# EAGLE board working (EAGLE 8.7.0), part 1 of 2
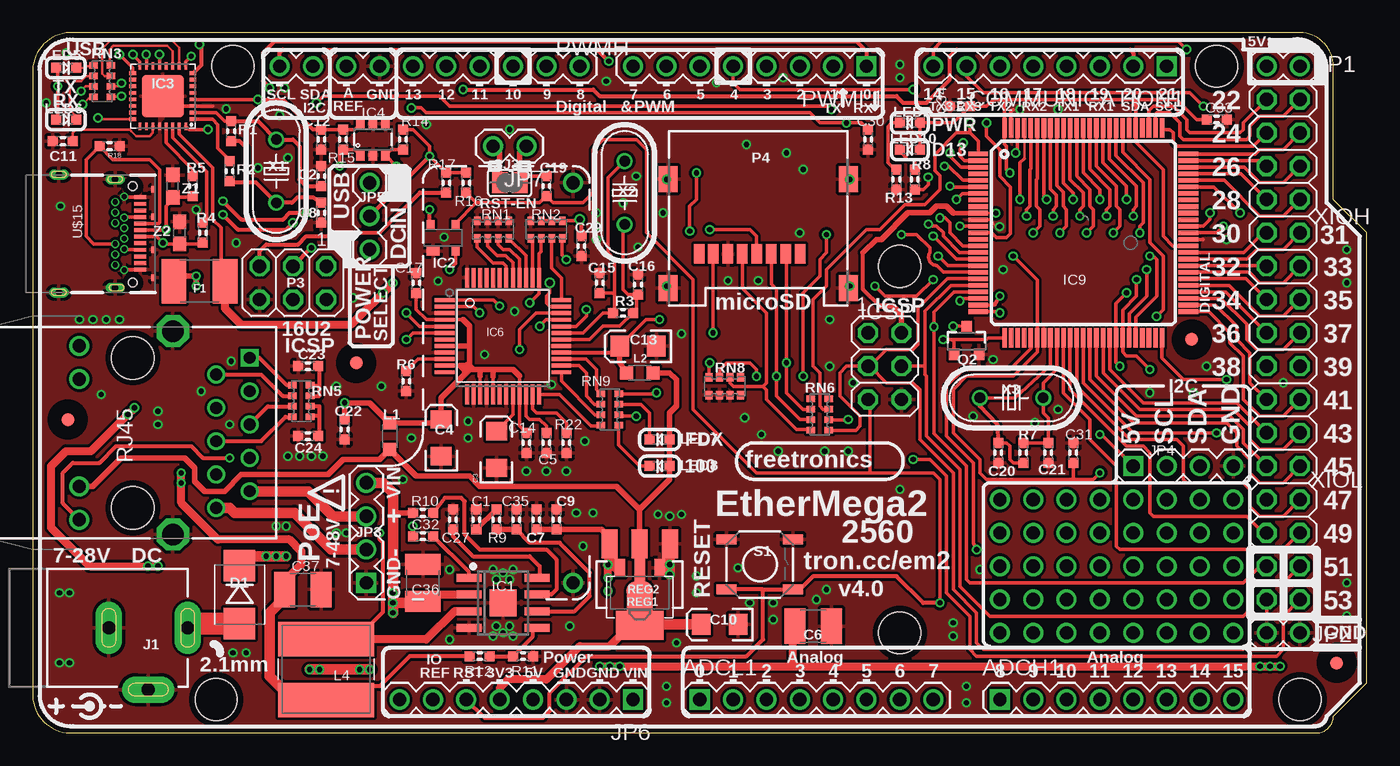
[diagram p1: board, top side]
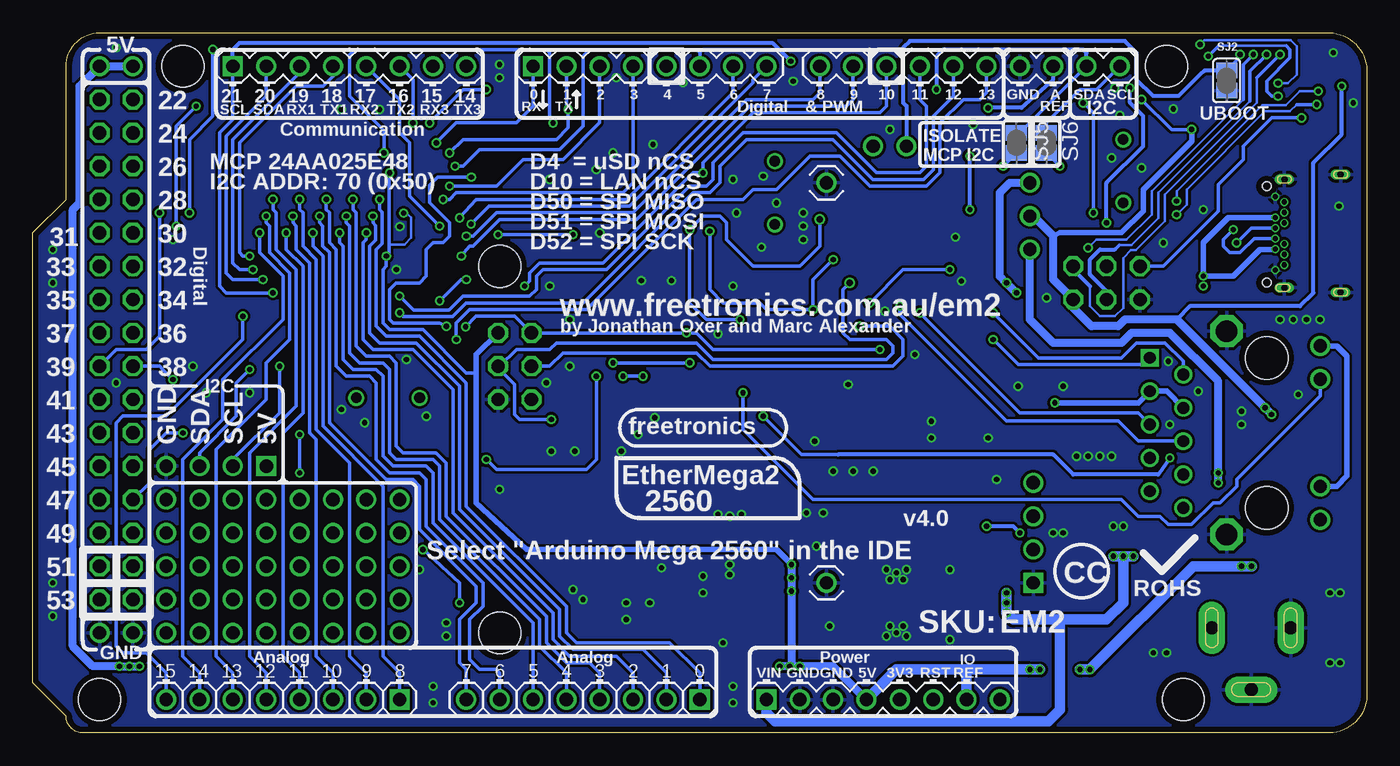
[diagram p2: board, bottom side, seen from below]

Size 101.6 x 53.34 mm. Coordinates in mm from the lower left corner, seen from the top.
Outline: 0,2.54 arc74 2.54,0 97.79,0 arc90 99.06,1.27 101.6,3.81 101.6,38.1 99.06,40.64 99.06,50.8 arc90 96.52,53.34 2.54,53.34 arc74 0,50.8 0,2.54
Copper layers (1*16): Top 0.035mm / dielectric 1.5mm / Bottom 0.035mm
Design rules "default *": minimum track width 8mil, minimum drill 15mil, track to track 8mil, track to pad 8mil, pad to pad 8mil, via to via 8mil, smd to smd 6mil, copper to edge 18mil, drill to drill 8mil, minimum pad ring 4mil, minimum via ring 6mil, stop-mask expansion 4mil, vias tented up to drill 25mil, thermal gap 10mil
Holes 3.2 mm at 66.04,35.56 66.04,7.62 13.97,2.54 15.24,50.8 96.52,2.54 90.17,50.8
tRestrict: area 23.6,27.2 to 25.7,29.2; area 87.2,29 to 89.3,31; area 1.7,22.9 to 3.7,24.9; area 98.3,4.3 to 100.3,6.3

## Footprints (pad centres in the part's own frame; a part is rotated, then mirrored left to right if it is on the bottom)
1X08 = drill 1.016 square: 1 0,0 | drill 1.016: 2 2.54,0; 3 5.08,0; 4 7.62,0; 5 10.16,0; 6 12.7,0; 7 15.24,0; 8 17.78,0
0603 = smd 0.762 x 0.762: 1 -0.762,0; 2 0.762,0
EIA3216 = smd 1.4 x 1.6: A 1.4,0; C -1.4,0
C1210 = smd 1.6 x 2.7: 1 -1.4,0; 2 1.4,0
SMB-DIODE = smd 2.4 x 2.4: A 2.2,0; C -2.2,0
L1812 = smd 1.9 x 3.4: 1 -1.95,0; 2 1.95,0
FIDUCIAL-1X2.5 = smd 1 x 1: 1 0,0
SO08T = smd 1.905 x 0.6: 1 -2.6,1.905; 2 -2.6,0.635; 3 -2.6,-0.635; 4 -2.6,-1.905; 5 2.6,-1.905; 6 2.6,-0.635; 7 2.6,0.635; 8 2.6,1.905 | smd 2.057 x 2.057: 9 0,0
SOT143-R = smd 1 x 0.7: 1 -0.75,-1 | smd 0.6 x 0.7: 2 0.95,-1; 3 0.95,1; 4 -0.95,1
ATMEL_QFN32 = smd 0.6 x 0.3: 1 -2.3,1.75; 2 -2.3,1.25; 3 -2.3,0.75; 4 -2.3,0.25; 5 -2.3,-0.25; 6 -2.3,-0.75; 7 -2.3,-1.25; 8 -2.3,-1.75; 17 2.3,-1.75; 18 2.3,-1.25; 19 2.3,-0.75; 20 2.3,-0.25; 21 2.3,0.25; 22 2.3,0.75; 23 2.3,1.25; 24 2.3,1.75 | smd 0.3 x 0.6: 9 -1.75,-2.3; 10 -1.25,-2.3; 11 -0.75,-2.3; 12 -0.25,-2.3; 13 0.25,-2.3; 14 0.75,-2.3; 15 1.25,-2.3; 16 1.75,-2.3; 25 1.75,2.3; 26 1.25,2.3; 27 0.75,2.3; 28 0.25,2.3; 29 -0.25,2.3; 30 -0.75,2.3; 31 -1.25,2.3; 32 -1.75,2.3 | smd 3.2 x 3.2: EXP 0,0
SOT23-6 = smd 0.65 x 0.8: 1 -0.95,-1.2; 2 0,-1.2; 3 0.95,-1.2; 4 0.95,1.2; 5 0,1.2; 6 -0.95,1.2
W5500 = smd 1.5 x 0.3: 1 -4.45,2.75; 2 -4.45,2.25; 3 -4.45,1.75; 4 -4.45,1.25; 5 -4.45,0.75; 6 -4.45,0.25; 7 -4.45,-0.25; 8 -4.45,-0.75; 9 -4.45,-1.25; 10 -4.45,-1.75; 11 -4.45,-2.25; 12 -4.45,-2.75; 25 4.45,-2.75; 26 4.45,-2.25; 27 4.45,-1.75; 28 4.45,-1.25; 29 4.45,-0.75; 30 4.45,-0.25; 31 4.45,0.25; 32 4.45,0.75; 33 4.45,1.25; 34 4.45,1.75; 35 4.45,2.25; 36 4.45,2.75 | smd 0.3 x 1.5: 13 -2.75,-4.45; 14 -2.25,-4.45; 15 -1.75,-4.45; 16 -1.25,-4.45; 17 -0.75,-4.45; 18 -0.25,-4.45; 19 0.25,-4.45; 20 0.75,-4.45; 21 1.25,-4.45; 22 1.75,-4.45; 23 2.25,-4.45; 24 2.75,-4.45; 37 2.75,4.45; 38 2.25,4.45; 39 1.75,4.45; 40 1.25,4.45; 41 0.75,4.45; 42 0.25,4.45; 43 -0.25,4.45; 44 -0.75,4.45; 45 -1.25,4.45; 46 -1.75,4.45; 47 -2.25,4.45; 48 -2.75,4.45
TQFP100 = smd 1.5 x 0.35: 1 -8,6; 2 -8,5.5; 3 -8,5; 4 -8,4.5; 5 -8,4; 6 -8,3.5; 7 -8,3; 8 -8,2.5; 9 -8,2; 10 -8,1.5; 11 -8,1; 12 -8,0.5; 13 -8,0; 14 -8,-0.5; 15 -8,-1; 16 -8,-1.5; 17 -8,-2; 18 -8,-2.5; 19 -8,-3; 20 -8,-3.5; 21 -8,-4; 22 -8,-4.5; 23 -8,-5; 24 -8,-5.5; 25 -8,-6; 51 8,-6; 52 8,-5.5; 53 8,-5; 54 8,-4.5; 55 8,-4; 56 8,-3.5; 57 8,-3; 58 8,-2.5; 59 8,-2; 60 8,-1.5; 61 8,-1; 62 8,-0.5; 63 8,0; 64 8,0.5; 65 8,1; 66 8,1.5; 67 8,2; 68 8,2.5; 69 8,3; 70 8,3.5; 71 8,4; 72 8,4.5; 73 8,5; 74 8,5.5; 75 8,6 | smd 0.35 x 1.5: 26 -6,-8; 27 -5.5,-8; 28 -5,-8; 29 -4.5,-8; 30 -4,-8; 31 -3.5,-8; 32 -3,-8; 33 -2.5,-8; 34 -2,-8; 35 -1.5,-8; 36 -1,-8; 37 -0.5,-8; 38 0,-8; 39 0.5,-8; 40 1,-8; 41 1.5,-8; 42 2,-8; 43 2.5,-8; 44 3,-8; 45 3.5,-8; 46 4,-8; 47 4.5,-8; 48 5,-8; 49 5.5,-8; 50 6,-8; 76 6,8; 77 5.5,8; 78 5,8; 79 4.5,8; 80 4,8; 81 3.5,8; 82 3,8; 83 2.5,8; 84 2,8; 85 1.5,8; 86 1,8; 87 0.5,8; 88 0,8; 89 -0.5,8; 90 -1,8; 91 -1.5,8; 92 -2,8; 93 -2.5,8; 94 -3,8; 95 -3.5,8; 96 -4,8; 97 -4.5,8; 98 -5,8; 99 -5.5,8; 100 -6,8
2X03 = drill 1.016 octagon: 1 -2.54,-1.27; 2 -2.54,1.27; 3 0,-1.27; 4 0,1.27; 5 2.54,-1.27; 6 2.54,1.27
POWER_JACK_PTH_SLOTS = drill 1 pad 2 long: GND 0,7.7; GNDBREAK 4.7,10.7; PWR 0,13.7
1X02 = drill 1.016: 1 0,0; 2 2.54,0
FT-POE-MODULE-CLEAN = drill 1.016 square: 1 0,0 | drill 1.016: 2 2.54,0; 3 5.08,0; 4 7.62,0; MNT1 0,-15.748; MNT2 30.48,-15.748
1X04 = drill 1.016 square: 1 0,0 | drill 1.016: 2 2.54,0; 3 5.08,0; 4 7.62,0
1X03 = drill 1.016: 1 0,0; 2 2.54,0; 3 5.08,0
L2012C = smd 1 x 1: 1 -1,0; 2 1,0
CDRH = smd 7.3 x 2.65: 1 0,2.325; 2 0,-2.325
LED-0603 = smd 0.762 x 0.762: A -0.762,0; C 0.762,0
MOLEX-SD-500901-003 = smd 0.8 x 1.5: 1 -3.2,9.35; 2 -2.1,9.35; 3 -1,9.35; 4 0.1,9.35; 5 1.2,9.35; 6 2.3,9.35; 7 3.4,9.35; 8 4.5,9.35 | smd 1.45 x 2: GND1 6.875,11.95; GND2 -6.875,11.95; GND3 6.875,3.65; GND4 -6.875,3.65
1X10 = drill 1.016: 1 0,0; 2 2.54,0; 3 5.08,0; 4 7.62,0; 5 10.16,0; 6 12.7,0; 7 15.24,0; 8 17.78,0; 9 20.32,0; 10 22.86,0
SOT23-3 = smd 0.8 x 0.9: 1 -0.95,-1; 2 0.95,-1; 3 0,1.1
SOT89 = smd 0.8 x 1.4: 1 -1.524,-1.905; 3 1.524,-1.905 | smd 0.8 x 1.9: 2 0,-1.651 | smd 2.032 x 3.65: 4 0,0.94
SOT223 = smd 1.219 x 2.235: 1 -2.311,-3.099; 2 0,-3.099; 3 2.311,-3.099 | smd 3.6 x 2.2: 4 0,3.099
CAY16 = smd 0.5 x 0.65: 1 -1.2,-0.675; 2 -0.4,-0.675; 3 0.4,-0.675; 4 1.2,-0.675; 5 1.2,0.675; 6 0.4,0.675; 7 -0.4,0.675; 8 -1.2,0.675
TACTILE_SWITCH_SMD = smd 1.524 x 0.762: 1 -2.54,1.905; 2 2.54,1.905; 3 -2.54,-1.905; 4 2.54,-1.905
SJ = smd 1.168 x 1.6: 1 -0.762,0; 2 0.762,0
SJC = smd 1.168 x 1.6: 1 -0.762,0; 2 0.762,0
HY931147C = drill 1.63 octagon: GND1 3.05,7.745; GND2 3.05,-7.745 | drill 0.9 square: P$1 8.89,5.715 | drill 0.9: P$2 6.35,4.445; P$3 8.89,3.175; P$4 6.35,1.905; P$5 8.89,0.635; P$6 6.35,-0.635; P$7 8.89,-1.905; P$8 6.35,-3.175; P$9 8.89,-4.445; P$10 6.35,-5.715 | drill 1.016: P$11 -4.08,6.625; P$12 -4.08,4.085; P$13 -4.08,-4.085; P$14 -4.08,-6.625 | hole 3.25: 0,5.715; 0,-5.715
USB-C-U52A = smd 0.3 x 0.9: A1 0.85,0.56; A2 1.35,0.56; A3 1.85,0.56; A4 2.35,0.56; A5 2.85,0.56; A6 3.35,0.56; A7 3.85,0.56; A8 4.35,0.56; A9 4.85,0.56; A10 5.35,0.56; A11 5.85,0.56; A12 6.35,0.56 | drill 0.4 pad 0.6: B1 6.4,-0.65; B2 6,-1.35; B3 5.2,-1.35; B4 4.8,-0.65; B5 4.4,-1.35; B6 4,-0.65; B7 3.2,-0.65; B8 2.8,-1.35; B9 2.4,-0.65; B10 2,-1.35; B11 1.2,-1.35; B12 0.8,-0.65 | smd 0.5 x 0.3: CASE1 0.23,1.55; CASE2 2.35,1.55; CASE3 4.85,1.55; CASE4 6.98,1.55 | drill 0.5 pad 0.7 long: FIX1 -0.89,-5.64; FIX2 -0.53,-1.35; FIX3 7.73,-1.35; FIX4 8.09,-5.64 | hole 0.65: 7.35,0; 0,0
HC49U-V = drill 0.813: 1 -2.413,0; 2 2.413,0
2X08 = drill 1.016 octagon: 1 -8.89,-1.27; 2 -8.89,1.27; 3 -6.35,-1.27; 4 -6.35,1.27; 5 -3.81,-1.27; 6 -3.81,1.27; 7 -1.27,-1.27; 8 -1.27,1.27; 9 1.27,-1.27; 10 1.27,1.27; 11 3.81,-1.27; 12 3.81,1.27; 13 6.35,-1.27; 14 6.35,1.27; 15 8.89,-1.27; 16 8.89,1.27
0603' = smd 1.1 x 1: 1 -0.85,0; 2 0.85,0

## Placement (x,y rotation side)
ADCH1  [1X08]  73.66,2.54 0 top
ADCL1  [1X08]  50.8,2.54 0 top
C1  2.2nF 0603  [0603]  33.78,16.26 90 top
C2  22pF 0603  [0603]  21.97,42.42 270 top
C3  4.7uF 6.3V A TANT  [EIA3216]  35.31,21.59 90 top
C4  10uF 6.3V A TANT  [EIA3216]  31.11,22.48 90 top
C5  10nF  [0603]  39.12,22.1 270 top
C6  47uF 50V 1210 ceramic  [C1210]  59.44,8.13 180 top
C7  100nF 0603  [0603]  38.35,16.26 90 top
C8  22pF 0603  [0603]  21.97,39.62 90 top
C9  1uF 0603  [0603]  39.88,16.26 90 top
C10  10uF 6.3V A TANT  [EIA3216]  52.32,8.26 180 top
C11  1uF 0603  [0603]  2.29,45.09 180 top
C12  100nF 0603  [0603]  21.97,45.21 270 top
C13  10uF 6.3V A TANT  [EIA3216]  46.1,29.46 180 top
C14  100nF  [0603]  37.59,22.1 270 top
C15  13pF  [0603]  43.18,34.29 90 top
C16  13pF  [0603]  46.1,34.16 90 top
C17  100nF  [0603]  29.21,34.29 90 top
C19  100nF 0603  [0603]  39.12,41.66 270 top
C20  22pF 0603  [0603]  73.53,21.34 90 top
C21  22pF 0603  [0603]  77.34,21.34 90 top
C22  100nF  [0603]  23.75,23.11 270 top
C23  100nF  [0603]  20.95,27.94 180 top
C24  100nF  [0603]  20.95,22.61 180 top
C27  100nF 0603  [0603]  32,16.26 90 top
C29  100nF 0603  [0603]  41.78,37.08 270 top
C30  100nF  [0603]  63.63,45.21 270 top
C31  100nF  [0603]  79.25,21.34 90 top
C32  10nF 50V 0603  [0603]  29.72,14.99 0 top
C33  100nF  [0603]  90.17,46.74 0 top
C34  100nF  [0603]  70.61,47.75 180 top
C35  22pF NOT PLACED  [0603]  36.83,16.26 90 top
C36  10uF 50V 1210 ceramic  [C1210]  29.72,11.43 90 top
C37  22uF 10V 1210 ceramic  [C1210]  20.57,10.92 0 top
COMMUNICATION1  [1X08]  86.36,50.8 180 top
D1  1N4004 SMB  [SMB-DIODE]  15.75,10.54 270 top
F1  500mA PTC 1812  [L1812]  12.7,34.42 0 top
FID1  FIDUCIAL1X2.5  [FIDUCIAL-1X2.5]  24.64,28.19 0 top
FID2  FIDUCIAL1X2.5  [FIDUCIAL-1X2.5]  88.27,29.97 0 top
FID3  FIDUCIAL1X2.5  [FIDUCIAL-1X2.5]  2.67,23.88 0 top
FID4  FIDUCIAL1X2.5  [FIDUCIAL-1X2.5]  99.31,5.33 90 top
IC1  EUP3476SO08T  [SO08T]  35.81,9.91 0 top
IC2  APX811-44UG-7  [SOT143-R]  31.24,37.72 0 top
IC3  ATMEGA16U2-MU  [ATMEL_QFN32]  9.91,48.51 180 top
IC4  MCP24AA025E48  [SOT23-6]  25.91,45.21 0 top
IC6  W5500  [W5500]  35.81,30.23 0 top
IC9  ATMEGA2560-16AU  [TQFP100]  80.01,38.1 0 top
ICSP  ICSP:MAIN  [2X03]  64.9,27.94 270 top
J1  DC_2_1MM  [POWER_JACK_PTH_SLOTS]  -1.91,8 270 top
JP1  [1X02]  93.98,50.8 0 top
JP2  [1X02]  93.98,7.62 0 top
JP3  FT-POE-MODULE  [FT-POE-MODULE-CLEAN]  25.4,11.43 90 top
JP4  [1X04]  83.82,20.32 0 top
JP5  [1X03]  25.65,41.91 270 top
JP6  [1X08]  45.72,2.54 180 top
JP7  [1X02]  37.59,44.7 180 top
L1  Bourns MH2029-300Y 30R 3A 0805  [L2012C]  27.18,22.61 90 top
L2  Bourns MH2029-300Y 30R 3A 0805  [L2012C]  46.23,27.43 180 top
L4  CDRH6D38SMT  [CDRH]  22.35,4.83 0 top
LED2  PWR/BLUE  [LED-0603]  66.8,46.48 180 top
LED5  TX/YEL  [LED-0603]  2.54,50.67 0 top
LED6  RX/GRN  [LED-0603]  2.54,46.74 0 top
LED7  GREEN  [LED-0603]  47.75,22.35 180 top
LED8  YELLOW  [LED-0603]  47.75,20.32 180 top
LED10  D13/RED  [LED-0603]  66.8,44.45 180 top
P3  ICSP:USB  [2X03]  19.81,34.29 180 top
P4  microSD  [MOLEX-SD-500901-003]  55.24,45.85 180 top
PWMH  [1X10]  41.66,50.8 180 top
PWML1  [1X08]  63.5,50.8 180 top
Q2  2N7002  [SOT23-3]  71.12,29.84 0 top
R1  1M 0603  [0603]  15.11,45.85 90 top
R2  27R 0603  [0603]  14.99,42.8 270 top
R3  1M  [0603]  44.96,32 0 top
R4  22R 0603  [0603]  12.95,38.1 270 top
R5  22R 0603  [0603]  12.19,41.66 270 top
R6  12K3 1%  [0603]  28.45,26.8 90 top
R7  1M 0603  [0603]  75.44,21.34 270 top
R8  1K 0603  [0603]  67.18,42.16 90 top
R9  15K 0603  [0603]  35.31,16.26 270 top
R10  100K 0603  [0603]  29.72,16.76 0 top
R11  10K 1%  [0603]  37.34,5.84 180 top
R12  53.6K 1%  [0603]  34.04,5.84 180 top
R13  1K 0603  [0603]  65.79,42.16 90 top
R14  4K7  [0603]  28.19,45.21 270 top
R15  4K7  [0603]  23.62,45.21 270 top
R16  10K 0603  [0603]  33.02,41.91 90 top
R17  10K 0603  [0603]  31.5,41.91 90 top
R18  5.1K  [0603]  5.84,44.7 180 top
R22  10K  [0603]  40.64,22.1 90 top
REG1  LD1117-SOT89  [SOT89]  46.23,10.67 180 top
REG2  LD1117-SOT223  [SOT223]  46.23,11.3 180 top
RN1  10K  [CAY16]  35.05,38.35 0 top
RN2  10K  [CAY16]  39.12,38.35 0 top
RN3  1K  [CAY16]  5.28,49.66 270 top
RN5  49R9 1%  [CAY16]  20.45,25.27 270 top
RN6  1K  [CAY16]  59.94,24.26 270 top
RN8  2K2  [CAY16]  52.7,26.42 0 top
RN9  1K  [CAY16]  43.94,24.64 270 top
S1  RESET  [TACTILE_SWITCH_SMD]  55.37,12.83 0 top
SJ2  UBOOT  [SJ]  10.67,49.7 90 bottom
SJ3  RESET-EN  [SJC]  36.32,41.91 0 top
SJ5  [SJC]  26.67,44.96 270 bottom
SJ6  [SJC]  24.38,44.96 270 bottom
U1  HY931147C-RJ45  [HY931147C]  7.62,22.86 0 top
U$15  USB-C  [USB-C-U52A]  7.62,41.66 270 top
X1  16MHz  [HC49U-V]  18.54,42.8 90 top
X2  25MHz  [HC49U-V]  45.09,41.15 270 top
X3  16MHz  [HC49U-V]  74.55,25.53 180 top
XIOH  [2X08]  95.25,39.37 90 top
XIOL  [2X08]  95.25,19.05 90 top
Z1  PGB1010603  [0603']  10.67,41.66 90 top
Z2  PGB1010603  [0603']  11.18,38.1 90 top

## Tracks (layer width: path | path; a pad name or v marks a point on that pad's centre or on a via)
3.3V
  Top 0.254: C10.A 50.8,8.38
  Top 0.305: REG1.4 REG2.4 | REG2.2 46.23,14.35
  Top 0.406: U1.P$13 4.55,18.77 6.73,20.95 11.56,20.95 12.32,20.19 12.32,19.18 13.08,18.41 14.61,18.41 15.88,19.68 22.48,19.68 23.62,20.83 26.42,20.83 27.18,21.59 | 27.18,21.59 29.21,19.56 33.27,19.56 34.04,18.8 44.45,18.8 46.23,17.02 | 46.23,17.02 REG2.2 | 46.23,17.02 48.51,19.3 LED8.A LED7.A 48.51,24.38 49.02,24.89 49.02,26.92 48.51,27.43 L2.1 | L1.1 27.18,21.59
  Top 0.61: JP6.5 35.56,3.43 36.2,4.06 39.12,4.06 41.66,6.6 43.95,6.6 45.22,7.87 45.9,7.87 REG2.4 46.18,8.26 | REG1.2 REG1.4
  Top 0.813: REG2.2 REG1.2 | 46.18,8.26 C10.A | 45.9,7.87 45.21,7.87
  Bottom 0.406: U1.P$13 2.29,18.8 1.52,19.56 1.52,28.7 2.29,29.46 U1.P$11
3V3A  (via drill 0.4)
  Top 0.254: IC6.17 35.06,27.17 | IC6.15 34.06,27.21 | 32.79,31.48 IC6.4 29.99,31.48 29.21,32.26 C17.1 | IC6.8 32.52,29.48 | 37.06,27.2 IC6.21 37.06,23.39 C14.1 | IC6.11 32.55,27.98
  Top 0.406: C22.1 v23.75,25.15 25.64,25.15 L1.2 30.84,23.61 C4.A 31.11,25.53 32.89,27.3 | 32.89,27.3 33.27,27.69 | 33.27,27.69 33.53,27.69 | 33.53,27.69 34.04,27.69 | 34.04,27.69 35.05,27.69 | 35.05,27.69 36.58,27.69 37.06,27.2 | 34.06,27.21 34.06,27.66 34.04,27.69 | 35.06,27.17 35.06,27.67 35.05,27.69 | 33.27,27.69 33.27,27.94 | 33.27,27.94 33.27,28.19 | 33.27,28.19 33.27,29.46 | 33.27,29.46 33.27,30.99 32.79,31.48 | 32.52,29.48 33.26,29.48 33.27,29.46 | 33.02,27.98 32.55,27.98 32.84,27.69 | 33.02,27.98 33.24,27.98 33.27,27.94 | 32.84,27.69 33.27,27.69 | 32.84,27.69 32.89,27.63 32.89,27.3 | 33.27,27.94 33.53,27.69 | 33.02,27.98 33.24,28.19 33.27,28.19
  Bottom 0.406: U1.P$4 15.24,26.04 U1.P$3 17.4,25.15 v23.75,25.15
3V3D  (via drill 0.4, 0.5)
  Top 0.254: v51.56,38.35 54.61,38.35 55.12,37.85 55.12,36.52 P4.4 | RN2.7 RN2.6 RN2.5 41.57,39.03 v41.66,39.12 | v47.74,31.49 46.72,31.49 C13.A
  Top 0.305: C13.A 44.21,28.98 IC6.28 | C29.1 41.78,38.99 v41.66,39.12
  Top 0.406: C13.A 44.7,28.21 L2.2
  Bottom 0.254: v41.66,39.12 41.66,37.08 43.18,35.56 46.74,35.56 48.77,37.59 48.77,38.86 49.28,39.37 50.55,39.37 v51.56,38.35 51.56,32.77 50.28,31.49 v47.74,31.49
5V  (via drill 0.4)
  Top 0.203: IC9.31 76.45,30.04 | IC9.10 73.25,39.6 v73.36,39.6
  Top 0.254: IC3.4 v17.14,48.26 | 43.92,14.88 REG2.3 | C33.1 88.65,46.74 87.12,48.26 84.07,48.26 | IC9.61 86.85,37.1 86.11,37.85 86.11,42.93 84.01,45.02 IC9.80 84.01,48.2 84.07,48.26 | v74.68,36.32 76.51,34.49 IC9.31 76.51,29.01 74.68,27.18 71.12,27.18 70.1,26.16 70.1,22.86 72.14,20.83 72.14,19.81 72.64,19.3 79.25,19.3 | 73.91,48.26 73.15,48.26 72.64,47.75 C34.1 70.1,46.48 LED2.A LED10.A | v74.42,42.67 74.17,42.93 74.17,44.7 74.01,44.86 IC9.100 74.01,48.16 73.91,48.26 | 79.25,19.3 80.77,19.3 v81.28,19.81 | v81.28,22.73 81.41,22.73 JP4.1 | 79.25,19.3 C31.1 | 73.91,48.26 84.07,48.26 | C12.1 R15.1 24.52,45.97 IC4.6 | R14.1 28.96,45.97 30.23,44.7 v30.23,43.94 R17.2 R16.2 | LED5.A 1.91,50.55 v1.91,49.28 1.91,46.86 LED6.A | v13.34,45.97 11.9,45.97 IC3.32
  Top 0.305: 63.25,36.58 63.25,33.78 64.52,32.51 | 43.69,14.99 43.92,14.76 REG2.3 | v17.14,48.26 19.05,48.26 21.34,45.97 C12.1 | IC2.4 30.23,38.78 v30.23,39.88 | JP5.2 v30.23,43.94
  Top 0.356: 70.13,39.6 IC9.10
  Top 0.406: 70.13,39.6 69.6,40.13 68.83,40.13 68.33,39.62 66.67,39.62 64.64,37.59 64.26,37.59 63.25,36.58 | 64.52,32.51 65.53,32.51 66.17,31.88 ICSP.2 | C7.1 C9.1 43.31,15.49 43.92,14.88
  Top 0.61: v43.18,5.08 57.91,5.08 | 57.91,5.08 v95,5.08 | v43.81,11.81 v43.81,12.83 | 43.92,12.93 44.27,12.57 REG1.3 | v9.53,12.7 v8.76,12.7 4.32,12.7 1.4,15.62 1.4,20.32 2.54,21.46 4.45,21.46 v7.24,24.26 v7.75,24.77 | 58.04,8 C6.2 57.91,8 57.91,5.08
  Top 0.813: REG2.3 43.92,12.93 v43.81,12.83 | v21.08,4.83 v25.65,4.83
  Bottom 0.203: v73.36,39.6 73.13,39.6 72.77,39.24 72.77,37.72 73.28,37.21 74.47,37.21
  Bottom 0.254: v13.34,45.97 14.86,45.97 v17.14,48.26 | P3.2 22.48,33.02 | v74.42,42.67 74.47,42.62 74.47,37.21 74.47,36.52 v74.68,36.32 74.68,35.56 74.93,35.31 74.93,31.24 74.42,30.73 71.88,30.73 68.58,27.43 67.82,27.43 | v81.28,19.81 v81.28,22.73
  Bottom 0.305: v30.23,39.88 v30.23,43.94 | 14.48,31.5 13.46,32.51 5.08,32.51 4.06,33.53 4.06,43.43 1.91,45.59 v1.91,49.28
  Bottom 0.406: v13.34,45.97 13.34,45.09 17.02,41.4 17.02,39.75 18.67,38.1 23.37,38.1 23.88,37.85 | ICSP.2 67.82,28.83 67.82,27.43 67.82,17.53 64.01,13.97 44.96,13.97 v43.81,12.83
  Bottom 0.61: JP1.1 JP1.2 98.04,49.28 98.04,40.39 98.55,39.88 98.55,6.6 97.03,5.08 v95,5.08 v94.23,5.08 v93.47,5.08 | v43.94,5.08 v43.18,5.08 40.64,5.08 JP6.4 | v43.94,5.08 v44.7,5.08 | JP5.2 25.4,39.37 23.88,37.85 23.88,34.54 P3.2 22.35,32.38 20.95,30.99 18.92,30.99 18.41,31.5 14.48,31.5 v7.24,24.26 | v43.81,12.83 v43.81,11.81 v43.81,10.79 43.81,5.21 v43.94,5.08
  Bottom 0.813: v8.76,12.7 13.21,12.7 v21.08,4.83 v21.84,4.83 | v24.89,4.83 v25.65,4.83 30.48,4.83 | 30.48,4.83 35.81,4.83 JP6.4 | JP6.7 30.48,4.83
5V_PSU  (via drill 0.4)
  Top 0.305: R12.2 28.7,5.84 26.42,3.56 23.41,3.56 L4.2
  Top 0.61: v11.3,19.81 v11.3,19.05 11.3,17.53 14.1,14.73 19.56,14.73 20.45,13.84 20.45,12.83 19.3,11.68 19.3,11.05 C37.1
  Top 0.813: C37.1 19.17,10.28 18.03,9.14 18.03,4.32 19.81,2.54 22.31,2.54 L4.2
  Bottom 0.61: JP5.3 25.65,31.5 23.88,29.72 18.67,29.72 17.91,30.48 14.99,30.48 11.3,26.8 v11.3,19.05
A8  (via drill 0.4)
  Top 0.254: v80.26,38.1 80.77,38.61 80.77,39.88 80.52,40.13 80.52,41.4 79.51,42.41 IC9.89
  Bottom 0.254: ADCH1.1 73.66,4.57 74.93,5.84 74.93,18.8 79.5,23.37 79.5,36.32 80.26,37.08 v80.26,38.1
A9  (via drill 0.4)
  Top 0.254: v81.28,40.64 81.28,41.4 80.01,42.67 IC9.88
  Bottom 0.254: ADCH1.2 76.2,4.57 77.47,5.84 77.47,20.57 80.01,23.11 80.01,36.07 81.03,37.08 81.03,39.62 81.28,39.88 v81.28,40.64
A10  (via drill 0.4)
  Top 0.254: v81.79,39.37 81.79,39.88 82.04,40.13 82.04,41.4 80.51,42.93 IC9.87
  Bottom 0.254: ADCH1.3 78.74,4.57 80.01,5.84 80.01,22.35 80.52,22.86 80.52,35.81 81.53,36.83 81.53,38.61 81.79,38.86 v81.79,39.37
A11  (via drill 0.4)
  Top 0.254: v82.3,38.1 82.8,38.61 82.8,39.88 82.55,40.13 82.55,41.66 81.01,43.2 IC9.86
  Bottom 0.254: ADCH1.4 81.28,4.57 82.55,5.84 82.55,22.86 81.03,24.38 81.03,35.56 82.3,36.83 v82.3,38.1
A12  (via drill 0.4)
  Top 0.254: v83.31,40.64 83.31,41.66 81.51,43.46 IC9.85
  Bottom 0.254: ADCH1.5 83.82,4.57 85.09,5.84 85.09,21.34 81.53,24.89 81.53,35.31 83.06,36.83 83.06,39.62 83.31,39.88 v83.31,40.64
A13  (via drill 0.4)
  Top 0.254: v83.82,39.37 83.82,39.88 84.07,40.13 84.07,41.66 82.01,43.72 IC9.84
  Bottom 0.254: ADCH1.6 86.36,4.57 87.63,5.84 87.63,21.59 83.82,25.4 83.82,28.19 82.04,29.97 82.04,35.05 83.57,36.58 83.57,38.61 83.82,38.86 v83.82,39.37
A14  (via drill 0.4)
  Top 0.254: v84.33,38.1 84.33,38.61 84.58,38.86 84.58,41.91 82.51,43.98 IC9.83
  Bottom 0.254: ADCH1.7 88.9,4.57 90.17,5.84 90.17,20.83 87.12,23.88 87.12,26.92 82.55,31.5 82.55,34.8 84.33,36.58 v84.33,38.1
A15  (via drill 0.4)
  Top 0.254: v85.6,31.75 86.11,32.26 86.11,36.32 85.09,37.34 85.09,42.16 83.01,44.24 IC9.82
  Bottom 0.254: ADCH1.8 91.44,4.57 92.96,6.1 94.74,6.1 95.25,6.6 95.25,23.62 94.74,24.13 91.44,24.13 85.6,29.97 v85.6,31.75
ACTLED
  Top 0.254: IC6.27 42.14,28.48 42.93,27.69 42.93,26.18 RN9.1
ADC0  (via drill 0.4)
  Top 0.203: 75.51,43.76 IC9.97
  Top 0.254: v75.18,40.64 75.18,43.43 75.51,43.76
  Bottom 0.254: v75.18,40.64 75.18,39.88 74.98,39.67 74.98,37.29 75.44,36.83 75.44,30.99 74.68,30.23 72.14,30.23 68.58,26.67 68.58,17.27 60.96,9.65 60.96,7.62 60.2,6.86 53.09,6.86 50.8,4.57 ADCL1.1
ADC1  (via drill 0.4)
  Top 0.254: v75.69,39.37 75.69,39.88 75.95,40.13 75.95,42.9 76.01,42.99 IC9.96
  Bottom 0.254: v75.69,39.37 75.69,38.86 75.49,38.66 75.49,37.54 75.95,37.08 75.95,30.48 75.18,29.72 72.39,29.72 69.09,26.42 69.09,17.02 61.47,9.4 61.47,7.37 60.45,6.35 55.12,6.35 53.34,4.57 ADCL1.2
ADC2  (via drill 0.4)
  Top 0.254: v76.2,38.1 76.71,38.61 76.71,39.88 76.45,40.13 76.45,42.16 76.51,42.22 IC9.95
  Bottom 0.254: v76.2,38.1 76.2,37.59 76.45,37.34 76.45,29.97 75.69,29.21 72.64,29.21 69.6,26.16 69.6,16.76 61.98,9.14 61.98,7.11 60.71,5.84 57.15,5.84 55.88,4.57 ADCL1.3
ADC3  (via drill 0.4)
  Top 0.254: v77.22,40.64 77.01,40.85 IC9.94
  Bottom 0.254: v77.22,40.64 77.22,39.88 76.96,39.62 76.96,29.46 76.2,28.7 74.42,28.7 73.91,28.19 73.91,21.84 73.41,21.34 70.87,21.34 70.1,20.57 70.1,16.51 62.48,8.89 62.48,6.86 60.96,5.33 59.18,5.33 58.42,4.57 ADCL1.4
ADC4  (via drill 0.4)
  Top 0.254: v77.72,39.37 77.72,39.88 77.98,40.13 77.98,40.97 77.51,41.44 IC9.93
  Bottom 0.254: v77.72,39.37 77.72,38.86 77.47,38.61 77.47,28.96 76.71,28.19 74.93,28.19 74.42,27.69 74.42,21.34 73.91,20.83 71.12,20.83 70.61,20.32 70.61,16.26 62.99,8.64 62.99,6.6 60.96,4.57 ADCL1.5
ADC5  (via drill 0.4)
  Top 0.254: v78.23,38.1 78.74,38.61 78.74,39.88 78.49,40.13 78.49,41.21 78.01,41.69 IC9.92
  Bottom 0.254: v78.23,38.1 78.23,37.34 77.98,37.08 77.98,28.45 77.22,27.69 75.44,27.69 74.93,27.18 74.93,21.08 74.17,20.32 71.63,20.32 71.12,19.81 71.12,16 63.5,8.38 ADCL1.6
ADC6  (via drill 0.4)
  Top 0.203: v79.25,40.64 79.27,40.66
  Top 0.254: 79.27,40.66 79.27,41.12 78.51,41.89 IC9.91
  Bottom 0.254: v79.25,40.64 79.25,39.88 78.99,39.62 78.99,37.34 78.49,36.83 78.49,27.94 77.72,27.18 75.95,27.18 75.44,26.67 75.44,20.83 74.42,19.81 72.14,19.81 71.63,19.3 71.63,15.75 67.31,11.43 67.31,9.65 68.33,8.64 68.33,5.59 67.56,4.83 66.29,4.83 66.04,4.57 ADCL1.7
ADC7  (via drill 0.4)
  Top 0.254: v79.76,39.37 79.76,39.88 80.01,40.13 80.01,41.15 79.01,42.15 IC9.90
  Bottom 0.254: v79.76,39.37 79.76,38.86 79.52,38.62 79.52,37.1 79.01,36.58 78.99,36.05 78.99,23.62 74.68,19.3 72.64,19.3 72.14,18.8 72.14,15.49 67.82,11.18 67.82,9.91 69.09,8.64 69.09,5.33 68.58,4.83 ADCL1.8
AREF  (via drill 0.4)
  Top 0.254: IC9.98 75.01,44.53 v74.85,44.2 | v28.83,47.62 29.59,47.62 29.97,47.24 59.18,47.24 59.94,46.48 v61.98,46.48 63.12,46.48 C30.1
  Bottom 0.254: v61.98,46.48 62.23,46.99 62.23,51.82 62.48,52.07 77.09,52.07 77.47,51.69 77.47,48.51 74.85,45.9 v74.85,44.2
  Bottom 0.305: v28.83,47.62 26.29,47.62 23.88,49.78 PWMH.8
D0_RX  (via drill 0.4)
  Top 0.203: RN3.4 4.39,48.46 v3.81,47.88
  Top 0.254: IC9.2 70.95,43.6 70.61,43.94 70.61,44.45 v70.87,44.96
  Top 0.305: v19.81,38.86 19.3,38.35 15.62,38.35 v14.48,39.5 | PWML1.1 63.5,51.94 62.74,52.7 18.41,52.7 17.53,51.82 17.53,49.66 v18.03,49.15
  Bottom 0.203: 5.33,47.88 5.84,47.37 7.75,47.37 13.72,41.4 13.72,40.26 v14.48,39.5
  Bottom 0.254: v3.81,47.88 5.33,47.88 | PWML1.1 63.5,47.75 64.77,46.48 69.34,46.48 v70.87,44.96
  Bottom 0.305: v18.03,49.15 18.03,48.01 17.02,46.99 17.02,44.7 19.81,41.91 v19.81,38.86
D1_TX  (via drill 0.4)
  Top 0.203: RN3.3 4.04,49.26 v3.68,48.9
  Top 0.254: v69.85,44.2 69.85,43.94 70.69,43.1 IC9.3 | v21.59,48.01 22.1,48.51 30.99,48.51 31.75,47.75 60.45,47.75 v60.83,47.5
  Top 0.305: v20.83,39.62 19.56,39.62 19.05,39.12 15.88,39.12 v14.48,40.51
  Bottom 0.203: v3.68,48.9 5.08,48.9 6.17,47.83 7.95,47.83 14.48,41.27 v14.48,40.51
  Bottom 0.254: v21.59,48.01 20.83,47.24 v20.83,39.62 | PWML1.2 60.96,47.62 v60.83,47.5 60.83,46.1 61.72,45.21 68.83,45.21 v69.85,44.2
D2  (via drill 0.4)
  Top 0.254: v69.85,41.66 69.91,41.6 IC9.6
  Bottom 0.254: PWML1.3 58.42,46.48 61.21,43.69 64.26,43.69 66.29,41.66 v69.85,41.66
D3  (via drill 0.4)
  Top 0.254: v70.36,40.64 70.82,41.1 IC9.7
  Bottom 0.254: v70.36,40.64 69.85,40.64 69.34,41.15 56.64,41.15 55.88,41.91 PWML1.4
D4  (via drill 0.4)
  Top 0.254: 71.37,45.72 70.36,45.72 68.71,44.07 68.71,42.85 69.09,42.47 69.09,41.4 67.94,40.26 66.42,40.26 64.52,38.35 63.5,38.35 60.45,35.31 60.45,34.04 59.44,33.02 59.44,27.94 59.94,27.43 59.94,24.89 60.18,24.66 RN6.7 | 71.37,45.72 72.01,45.08 IC9.1 | v67.06,49.02 53.85,49.02 53.34,49.53 PWML1.5 | 71.37,45.72 v71.37,46.48
  Bottom 0.254: v71.37,46.48 68.83,49.02 v67.06,49.02
D5  (via drill 0.4)
  Top 0.254: v69.44,43.18 69.75,43.18 70.83,42.1 IC9.5
  Bottom 0.254: v69.44,43.18 68.83,43.18 67.56,44.45 61.47,44.45 59.69,46.23 59.69,51.56 59.18,52.07 51.05,52.07 50.8,51.82 PWML1.6
D6  (via drill 0.4)
  Top 0.254: v69.09,39.24 69.47,39.24 69.85,38.86 69.85,38.1 70.85,37.1 IC9.15
  Bottom 0.254: v69.09,39.24 67.82,40.64 56.39,40.64 48.26,48.77 PWML1.7
D7  (via drill 0.4)
  Top 0.254: v68.22,38.76 68.38,38.61 68.83,38.61 69.34,38.1 69.34,37.85 70.59,36.6 IC9.16
  Bottom 0.254: v68.22,38.76 66.85,40.13 56.13,40.13 46.74,49.53 46.74,49.78 PWML1.8
D8  (via drill 0.4)
  Top 0.254: v68.58,37.85 70.34,36.1 IC9.17
  Bottom 0.254: PWMH.1 41.66,48.77 42.16,48.26 47.24,48.26 55.88,39.62 66.29,39.62 68.07,37.85 v68.58,37.85
D9  (via drill 0.4)
  Top 0.254: v68.96,36.32 69.69,35.6 IC9.18
  Bottom 0.254: PWMH.2 39.12,48.26 39.62,47.75 46.99,47.75 55.63,39.12 66.04,39.12 68.07,37.08 68.33,37.08 v68.96,36.32
D10_SS  (via drill 0.4)
  Top 0.254: v70.61,32.91 70.79,33.1 IC9.23 | v68.58,34.54 67.31,33.27 64.9,33.27 v64.14,34.04 | v40.64,36.07 40.32,36.39 RN2.4 | IC6.32 41.39,30.98 42.16,31.75 v42.16,32.26 | v50.55,42.67 50.55,40.64 50.04,40.13 v50.04,38.23
  Bottom 0.254: PWMH.3 36.58,47.75 37.08,47.24 46.74,47.24 50.55,43.43 v50.55,42.67 51.31,42.67 58.17,35.81 62.99,35.81 63.75,35.05 63.75,34.42 v64.14,34.04 | v50.04,38.23 50.04,33.78 49.02,32.77 46.23,32.77 45.72,32.26 v42.16,32.26 42.16,34.54 v40.64,36.07 | v68.58,34.54 68.98,34.54 v70.61,32.91
D11  (via drill 0.4)
  Top 0.254: v73.66,33.27 73.24,32.6 IC9.24
  Bottom 0.254: v73.66,33.27 72.59,32.21 69.9,32.21 68.83,33.27 63.75,33.27 63.25,33.78 63.25,34.8 62.74,35.31 57.91,35.31 51.56,41.66 50.29,41.66 49.78,42.16 49.78,43.43 47.5,45.72 40.39,45.72 37.34,42.67 34.04,42.67 33.53,43.18 33.53,47.75 34.04,48.26 PWMH.4
D12  (via drill 0.4)
  Top 0.254: v73.66,32 73.56,32.1 IC9.25
  Bottom 0.254: v73.66,32 73.38,31.73 69.62,31.73 68.58,32.77 59.69,32.77 59.44,33.02 51.31,41.15 50.04,41.15 49.28,41.91 49.28,43.18 47.24,45.21 40.64,45.21 37.59,42.16 33.78,42.16 33.02,42.93 33.02,46.99 31.5,48.51 PWMH.5
D13  (via drill 0.4)
  Top 0.254: IC9.26 72.77,30.1 72.64,29.97 69.85,29.97 | v69.34,29.97 69.85,29.97 | Q2.1 70.17,29.91 69.85,29.97
  Bottom 0.254: PWMH.6 28.96,48.77 29.46,48.26 30.73,48.26 32.51,46.48 32.51,42.67 33.53,41.66 37.85,41.66 40.13,43.94 42.42,43.94 44.96,41.4 46.74,41.4 47.5,40.64 51.05,40.64 59.44,32.26 68.33,32.26 69.34,31.24 v69.34,29.97
D22
  Top 0.254: XIOH.16 92.2,46.48 92.2,45.97 91.95,45.72 88.14,45.72 87.88,45.97 87.88,46.74 86.87,47.75 85.34,47.75 85.01,47.42 IC9.78
D23
  Top 0.254: XIOH.15 95.25,46.99 93.47,46.99 92.71,46.23 92.71,45.47 92.46,45.21 87.63,45.21 87.38,45.47 87.38,46.48 86.61,47.24 85.6,47.24 85.51,47.16 IC9.77
D24
  Top 0.203: IC9.76 86.14,45.97
  Top 0.254: XIOH.14 92.96,44.7 87.12,44.7 86.87,44.96 86.87,45.72 86.61,45.97 86.14,45.97
D25
  Top 0.254: XIOH.13 95.25,44.45 93.47,44.45 93.12,44.1 IC9.75
D26
  Top 0.254: IC9.74 93.38,43.6 XIOH.12
D27
  Top 0.254: XIOH.11 95.25,41.91 93.47,41.91 92.28,43.1 IC9.73
D28
  Top 0.254: XIOH.10 92.02,42.6 IC9.72
D29
  Top 0.254: XIOH.9 95.25,39.37 93.47,39.37 90.74,42.1 IC9.71
D30
  Top 0.203: 93.73,38.1 XIOH.8
  Top 0.254: 93.73,38.1 92.23,36.6 IC9.60
D31
  Top 0.254: XIOH.7 95.25,36.83 93.22,36.83 92.49,36.1 IC9.59
D32
  Top 0.254: IC9.58 93.51,35.6 93.55,35.56 XIOH.6
D33
  Top 0.254: XIOH.5 95.25,34.29 93.47,34.29 92.66,35.1 IC9.57
D34
  Top 0.254: XIOH.4 92.4,34.6 IC9.56
D35
  Top 0.254: XIOH.3 95.25,31.75 93.47,31.75 91.12,34.1 IC9.55
D36
  Top 0.254: XIOH.2 90.86,33.6 IC9.54
D37
  Top 0.254: IC9.53 90.5,33.1 92.46,31.15 92.46,29.97 93.22,29.21 95.25,29.21 XIOH.1
D38  (via drill 0.4)
  Top 0.254: v90.93,26.92 87.63,26.92 86.01,28.54 IC9.50
  Bottom 0.254: v90.93,26.92 91.69,27.69 91.95,27.94 XIOL.16
D39  (via drill 0.4)
  Top 0.254: IC9.70 89.97,41.6 v91.95,39.62
  Bottom 0.254: v91.95,39.62 91.95,30.23 92.96,29.21 95.25,29.21 XIOL.15
D40
  Top 0.254: IC9.52 90.08,32.6 91.69,30.99 91.69,29.97 92.71,28.96 92.71,26.67 XIOL.14
D41
  Top 0.254: IC9.51 89.57,32.1 91.19,30.48 91.19,29.72 92.2,28.7 92.2,25.4 93.47,24.13 95.25,24.13 XIOL.13
D42
  Top 0.254: XIOL.12 91.69,25.15 84.58,25.15 82.04,27.69 82.04,29.05 IC9.42
D43
  Top 0.254: XIOL.11 95.25,21.59 93.47,21.59 92.71,22.35 92.71,23.37 91.44,24.64 84.33,24.64 81.53,27.43 81.53,28.81 IC9.41
D44
  Top 0.254: IC9.40 81.03,28.56 81.03,27.18 84.07,24.13 91.19,24.13 92.2,23.11 92.2,22.1 XIOL.10
D45
  Top 0.254: XIOL.9 95.25,19.05 93.47,19.05 92.71,19.81 92.71,20.83 91.69,21.84 91.69,22.86 90.93,23.62 83.82,23.62 80.52,26.92 80.52,28.31 IC9.39
D46  (via drill 0.4)
  Top 0.254: v90.17,22.86 83.82,22.86 80.01,26.67 IC9.38
  Bottom 0.254: XIOL.8 92.71,19.05 92.71,21.59 91.44,22.86 v90.17,22.86
D47
  Top 0.254: XIOL.7 95.25,16.51 93.47,16.51 92.71,17.27 92.71,18.54 92.2,19.05 87.88,19.05 87.63,19.3 87.63,21.84 87.12,22.35 83.57,22.35 79.51,26.41 IC9.37
D48
  Top 0.203: 93.73,15.24 XIOL.6
  Top 0.254: 93.73,15.24 92.46,16.51 85.34,16.51 85.09,16.76 85.09,21.34 84.58,21.84 83.31,21.84 79.01,26.15 IC9.36
D49
  Top 0.254: XIOL.5 95.25,13.97 82.8,13.97 82.55,14.22 82.55,20.32 80.52,22.35 80.52,23.88 78.51,25.88 IC9.35
D50_MISO  (via drill 0.4)
  Top 0.254: IC9.22 70.18,33.6 68.63,32.05 v68.63,30.94 68.63,22.81 71.12,20.32 71.12,11.68 71.37,11.43 92.2,11.43 93.47,12.7 XIOL.4 | v37.08,29.21 37.08,30.73 38.33,31.98 IC6.34 | v51.82,30.48 51.82,36.47 P4.7
  Bottom 0.254: v68.63,30.94 67.82,31.75 64.9,31.75 ICSP.1 v51.82,30.48 51.05,30.48 49.78,29.21 v37.08,29.21
D51_MOSI  (via drill 0.4, 0.5)
  Top 0.254: ICSP.4 67.94,27.94 | 67.94,27.94 67.94,32.13 69.91,34.1 IC9.21 | XIOL.3 95.25,11.43 93.22,11.43 92.71,10.92 92.71,9.4 92.2,8.89 72.9,8.89 70.61,11.18 70.61,20.07 68.07,22.61 68.07,27.18 67.94,27.3 67.94,27.94 | v39.37,34.29 39.37,33.53 39.12,33.27 39.12,32.76 39.4,32.48 IC6.35 | RN6.6 61.87,23.86 v62.1,23.88
  Bottom 0.254: v62.1,23.88 64.52,23.88 64.9,24.26 64.9,26.54 66.17,27.81 ICSP.4 66.04,27.94 64.77,29.21 62.23,29.21 61.72,29.72 51.05,29.72 49.78,28.45 36.58,28.45 36.07,28.96 36.07,29.46 36.58,29.97 39.37,29.97 39.88,30.48 39.88,33.78 v39.37,34.29
D52_SCK  (via drill 0.4)
  Top 0.203: ICSP.3 63.75,27.94
  Top 0.254: XIOL.2 93.98,9.14 93.73,8.89 93.22,8.89 92.71,8.38 92.71,6.86 92.2,6.35 72.39,6.35 71.88,6.86 71.88,9.14 70.1,10.92 70.1,19.81 67.56,22.35 67.56,26.16 67.06,26.67 65.02,26.67 63.75,27.94 65.02,29.21 67.06,29.21 67.44,29.59 67.44,32.38 69.65,34.6 IC9.20 | ICSP.3 61.98,27.94 61.47,27.43 61.47,25.65 62.99,24.13 62.99,23.37 62.68,23.06 RN6.5 | v38.61,30.99 39.1,31.48 IC6.33
  Bottom 0.254: ICSP.3 62.23,27.94 61.21,28.96 51.05,28.96 50.04,27.94 36.07,27.94 35.31,28.7 35.31,29.97 36.32,30.99 v38.61,30.99
D53_SS  (via drill 0.4)
  Top 0.254: IC9.19 69.36,35.1 68.99,35.48 68.86,35.61 arc-120 68.33,36.58 68.33,36.96 67.31,37.97 v66.17,37.97 | XIOL.1 95.25,8.89 95.25,6.35 94.74,5.84 71.88,5.84 71.37,6.35 71.37,8.89 69.6,10.67 69.6,19.56 68.33,20.83 v67.06,20.83 | v60.45,37.97 60.45,36.58 59.94,36.07 59.94,34.8 58.67,33.53 v58.67,27.18
  Bottom 0.254: v60.45,37.97 v66.17,37.97 | v67.06,20.83 66.29,20.07 59.44,20.07 58.67,20.83 v58.67,27.18
D+  (via drill 0.4)
  Top 0.254: R5.2 12.1,40.81 Z1.1 10.67,40.64 10.16,40.13 v10.16,38.35 9.86,38.31 U$15.A6
  Bottom 0.254: U$15.B6 8.57,37.66 9.65,36.58 10.41,36.58 10.92,37.08 10.92,37.59 v10.16,38.35
D-  (via drill 0.4)
  Top 0.254: R4.2 12.87,37.25 Z2.1 9.99,37.25 v9.91,37.34 9.44,37.81 U$15.A7
  Bottom 0.254: U$15.B7 8.79,38.46 v9.91,37.34
DTR  (via drill 0.4)
  Top 0.203: v9.66,51.69 v9.65,51.69 | 35.69,42.04 SJ3.1
  Top 0.254: IC3.13 v9.66,51.69
  Top 0.406: JP7.2 35.56,44.2 SJ3.1
  Bottom 0.254: SJ2.2 9.65,51.49 v9.65,51.69
  Bottom 0.305: SJ2.2 12.36,50.46 12.7,50.16 14.35,48.51 16.26,48.51 17.53,49.78 17.53,51.82 18.41,52.7 34.8,52.7 35.31,52.2 35.31,48.01 35.05,47.75 JP7.2
EXRES1
  Top 0.254: IC6.10 29.36,28.48 R6.2
FDXLED
  Top 0.254: 40.28,27.96 IC6.26 41.62,27.98 42.16,27.43 42.16,25.65 42.78,25.04 RN9.2
GND  (via drill 0.4)
  Top 0.203: IC3.3 12.19,47.75 | IC9.62 87.89,37.6 87.88,37.59 | v73.64,38.58 73.4,38.58 72.88,39.1 IC9.11
  Top 0.254: IC3.3 10.66,47.76 IC3.EXP | 12.19,47.75 13.72,47.75 | REG1.1 47.75,12.83 48.51,13.59 48.51,14.38 REG2.1 | IC9.99 74.51,47.41 74.68,47.5 | 87.88,37.59 89.15,37.59 | IC9.32 | v62.23,34.04 62.23,34.01 P4.GND2 | U$15.A1 7.02,40.81 U$15.B12 | U$15.A12 7.02,35.31 U$15.B1
  Top 0.406: P4.GND1 48.37,33.93 v48.26,34.04
  Top 0.813: 48.51,13.59 v48.51,12.83 v48.51,12.06
  other vias: 70.1,8.38 22.1,21.08 53.72,12.57 50.55,10.67 50.55,11.94 54.61,9.91 30.86,34.42 19.18,49.15 14.73,47.55 2.54,51.82 12.45,39.88 15.49,37.34 6.6,31.5 70.1,7.37 41.4,16.76 24.38,33.15 29.97,46.35 43.69,49.66 3.56,31.5 4.57,31.5 5.59,31.5 1.02,48.01 66.04,18.54 60.33,21.46 52.07,49.53 19.43,43.81 5.21,25.78 48.26,2.29 48.26,3.56 49.02,6.86 2.11,40.13 60.71,31.5 42.93,39.62 52.96,34.47 26.54,26.42 23.11,26.42 15.11,28.32 12.83,26.04 14.99,23.5 9.53,24.51 9.53,23.5 48.01,39.62 21.21,21.08 20.32,21.08 19.43,21.08 19.3,15.75 18.54,15.75 56.39,9.91 78.11,47.5 71.63,24.13 73.91,35.31 90.93,37.59 60.71,27.94 66.04,50.93 100.08,36.83 31.32,37.77 89.41,27.94 56.39,8.64 60.45,10.92 59.69,10.16 73.15,28.45 85.09,25.91 88.39,25.91 57.15,49.91 54.36,44.83 58.67,42.93 62.1,21.46 55.5,22.73 57.4,44.2 95.25,26.67 72.14,12.45 71.12,3.56 71.12,2.29 75.18,47.5 78.11,24.64 76.33,23.62 62.48,26.67 44.96,40.39 45.97,42.42 36.32,11.68 35.31,11.68 35.31,8.13 36.32,8.13 35.81,12.19 36.58,12.45 35.81,7.62 35.05,12.45 36.58,7.37 35.05,7.37 40.89,8.13 48.51,16.51 23.11,15.24 23.88,15.24 2.03,10.67 2.03,5.33 2.79,5.33 2.79,10.67 16.26,6.1 15.24,6.1 42.67,16.76 41.91,14.22 31.75,12.45 28.19,19.3 49.4,16.64 47.62,16.64 31.75,7.11 54.23,24 56.77,21.46 100.08,34.29 100.08,8.89 100.08,11.43 66.04,49.91 17.14,43.05 95.25,52.2 36.32,45.97 18.8,47.04 48.26,42.16 62.23,42.16 42.93,38.61 42.93,37.59 58.42,38.1 34.42,28.83 28.83,22.48 33.15,23.75 36.7,32.13 55.24,34.47 33.15,22.48 42.04,22.23 37.59,19.94 39.12,19.94 40.64,19.94 49.4,30.4 46.1,37.01 39.5,26.54
  pour Bottom: 0,50.8 arc-74 2.54,53.34 96.52,53.34 arc-74 99.06,50.8 99.06,40.64 101.6,38.1 101.6,3.81 99.06,1.27 arc-74 97.79,0 2.54,0 arc-74 0,1.91
  pour Top: 0,50.8 arc-74 2.54,53.34 96.52,53.34 arc-74 99.06,50.8 99.06,40.64 101.6,38.1 101.6,3.81 99.06,1.27 arc-74 97.79,0 2.54,0 arc-74 0,1.91
INT
  Top 0.254: RN2.3 39.52,35.41 40.26,34.67 IC6.36
LINKLED
  Top 0.254: RN9.3 42.82,24.24 40.26,26.79 IC6.25
MISO2  (via drill 0.4)
  Top 0.254: IC3.17 7.61,50.69 v6.6,51.69
  Bottom 0.203: 8.38,49.91 8.38,48.01 15.37,41.02 15.37,38.99 17.58,36.78 17.96,36.78 18.54,36.2 18.54,32.38 19.18,31.75 20.32,31.75 21.08,32.51 21.08,34.04
  Bottom 0.254: 8.38,49.91 v6.6,51.69
  Bottom 0.305: 21.08,34.04 22.35,35.31 P3.1
MOSI2  (via drill 0.4)
  Top 0.254: IC3.16 8.16,51.15 v7.62,51.69
  Bottom 0.203: 8.89,48.13 15.88,41.15 15.88,39.22 17.93,37.16 18.85,37.16
  Bottom 0.254: v7.62,51.69 8.89,50.42 8.89,48.13 | 19.18,36.83 18.85,37.16
  Bottom 0.305: P3.4 19.81,33.66 21.08,34.92 21.08,36.07 20.32,36.83 19.18,36.83
N$1
  Top 0.305: RN5.6 21.84,24.87 21.84,24.13 | 21.84,24.13 21.12,24.13 RN5.5 | C24.1 21.84,22.61 21.84,24.13
N$2  (via drill 1.02 pad 1.52)
  other vias: 73.66,7.62
N$3  (via drill 1.02 pad 1.52)
  other vias: 76.2,7.62
N$4
  Top 0.254: LED10.C 66.04,44.32 66.67,43.69 67.06,43.69 67.19,43.55 R8.2
N$5  (via drill 1.02 pad 1.52)
  other vias: 78.74,7.62
N$6  (via drill 0.4)
  Top 0.254: v68.2,42.34 68.2,41.78 67.82,41.4 R8.1 | v70.1,30.99 70.57,30.99 Q2.3
  Bottom 0.254: v68.2,42.34 70.76,42.34 71.37,41.73 71.37,40.39 69.85,38.86 69.85,37.85 70.36,37.34 71.12,37.34 71.63,36.83 71.63,34.8 72.14,34.29 73.91,34.29 74.42,33.78 74.42,31.5 74.17,31.24 70.61,31.24 v70.1,30.99
N$7  (via drill 1.02 pad 1.52)
  other vias: 81.28,7.62
N$8
  Top 0.254: IC3.1 13.69,46.76 14.1,46.35 14.1,44.54 14.99,43.65 R2.1
N$9  (via drill 0.4)
  Top 0.254: IC4.1 24.52,44.45 R15.2 23.37,44.2 v23.37,43.18
  Bottom 0.254: SJ6.2 v23.37,43.18
N$10  (via drill 1.02 pad 1.52)
  other vias: 83.82,7.62
N$11
  Top 0.203: LED6.C 3.25,47.06 2.79,47.5 2.79,49.28 3.17,49.66 3.68,49.66 4.06,50.04 4.59,50.04 RN3.2
N$12
  Top 0.254: R13.2 65.66,42.93 65.13,43.46 65.13,46.2 65.41,46.48 LED2.C
N$13
  Top 0.203: LED5.C 3.92,50.65 4.06,50.8 4.55,50.8 RN3.1
N$15  (via drill 1.02 pad 1.52)
  other vias: 86.36,7.62
N$19  (via drill 0.4)
  Top 0.254: R14.2 27.3,44.45 IC4.3 v27.69,43.18
  Bottom 0.254: v27.69,43.18 SJ5.2
N$20
  Top 0.254: 55.61,26.4 55.88,26.67 55.88,32 54.05,33.84 P4.5 | 55.61,26.4 53.36,26.4 53.09,26.67 53.09,27.07 RN8.6 | RN6.4 59.21,23.11 58.17,23.11 55.88,25.4 55.88,26.12 55.61,26.4
N$21  (via drill 1.02 pad 1.52)
  other vias: 88.9,15.24
N$22  (via drill 1.02 pad 1.52)
  other vias: 73.66,10.16
N$24  (via drill 0.4)
  Top 0.254: P4.2 57.34,36.13 57.4,36.07 v57.4,28.19 57.4,25.91 58.67,24.64 59.25,24.64 RN6.2 | RN8.8 51.51,28.14 v51.56,28.19
  Bottom 0.254: v51.56,28.19 v57.4,28.19
N$25  (via drill 0.4)
  Top 0.254: P4.3 56.24,34.18 56.64,33.78 v56.64,27.18 56.64,25.65 58.42,23.88 59.25,23.88 RN6.3 | RN8.7 52.32,27.11 52.32,27.69 52.83,28.19 54.61,28.19 55.12,27.69 v55.12,27.18
  Bottom 0.254: v55.12,27.18 v56.64,27.18
N$26
  Top 0.254: 44.69,23.37 RN9.5 44.62,21.93 46.23,20.32 LED8.C
N$28  (via drill 0.4)
  Top 0.254: RN9.6 44.73,24.13 v45.97,24.13
  Top 0.305: v14.99,20.95 12.95,20.95 12.06,21.84 6.35,21.84 5.08,20.57 3.05,20.57 2.29,19.81 2.29,17.49 U1.P$14
  Bottom 0.254: 40.26,21.21 43.05,21.21 v45.97,24.13
  Bottom 0.305: v14.99,20.95 15.88,19.68 22.35,19.68 23.88,21.21 40.26,21.21
N$29  (via drill 1.02 pad 1.52)
  other vias: 76.2,10.16
N$30  (via drill 1.02 pad 1.52)
  other vias: 78.74,10.16
N$31  (via drill 1.02 pad 1.52)
  other vias: 81.28,10.16
N$32  (via drill 1.02 pad 1.52)
  other vias: 83.82,10.16
N$33  (via drill 1.02 pad 1.52)
  other vias: 86.36,10.16
N$34  (via drill 1.02 pad 1.52)
  other vias: 88.9,7.62
N$35  (via drill 1.02 pad 1.52)
  other vias: 73.66,12.7
N$36  (via drill 1.02 pad 1.52)
  other vias: 73.66,15.24
N$37  (via drill 1.02 pad 1.52)
  other vias: 73.66,17.78
N$38  (via drill 1.02 pad 1.52)
  other vias: 76.2,15.24
N$39  (via drill 1.02 pad 1.52)
  other vias: 76.2,17.78
N$40  (via drill 1.02 pad 1.52)
  other vias: 78.74,17.78
N$41  (via drill 1.02 pad 1.52)
  other vias: 78.74,15.24
N$42  (via drill 1.02 pad 1.52)
  other vias: 86.36,15.24
N$43  (via drill 1.02 pad 1.52)
  other vias: 88.9,10.16
N$44  (via drill 1.02 pad 1.52)
  other vias: 81.28,15.24
N$45  (via drill 1.02 pad 1.52)
  other vias: 83.82,15.24
N$46  (via drill 1.02 pad 1.52)
  other vias: 78.74,12.7
N$47  (via drill 1.02 pad 1.52)
  other vias: 81.28,12.7
N$48  (via drill 1.02 pad 1.52)
  other vias: 83.82,12.7
N$49  (via drill 1.02 pad 1.52)
  other vias: 86.36,12.7
N$50  (via drill 1.02 pad 1.52)
  other vias: 88.9,12.7
N$51  (via drill 1.02 pad 1.52)
  other vias: 76.2,12.7
N$52  (via drill 1.02 pad 1.52)
  other vias: 81.28,17.78
N$53  (via drill 1.02 pad 1.52)
  other vias: 83.82,17.78
N$54  (via drill 1.02 pad 1.52)
  other vias: 86.36,17.78
N$55  (via drill 1.02 pad 1.52)
  other vias: 88.9,17.78
N$56  (via drill 1.02 pad 1.52)
  other vias: 91.44,7.62
N$57  (via drill 1.02 pad 1.52)
  other vias: 91.44,15.24
N$58  (via drill 1.02 pad 1.52)
  other vias: 91.44,17.78
N$59  (via drill 1.02 pad 1.52)
  other vias: 91.44,12.7
N$60
  Top 1.676: J1.PWR 12.47,8.34 D1.A
N$61  (via drill 1.02 pad 1.52)
  other vias: 91.44,10.16
N$62
  Top 0.254: IC6.39 37.56,36.37 RN1.4
N$63
  Top 0.254: IC6.40 37.06,36.09 36.32,36.83 35.81,36.83 35.45,37.19 RN1.3
N$64
  Top 0.305: 38.61,11.87 38.61,12.7 37.85,13.46 33.53,13.46 32,14.99 C27.1
  Top 0.406: 38.61,11.87 IC1.8
N$65
  Top 0.406: R9.1 C1.1
N$66
  Top 0.305: C35.1 37.85,14.48 40.13,14.48 42.42,12.19 42.42,10.41 41.27,9.27 IC1.6
  Top 0.406: C35.1 R9.2
N$67
  Top 0.254: U$15.A5 9.6,38.81 9.65,38.86 9.65,42.93 8.89,43.69 6.1,43.69 R18.2 4.06,43.69 4.06,37.85 4.65,37.26 U$15.B5
N$68
  Top 0.813: U1.P$9 20.95,18.41 22.86,16.51 JP3.3
N$69
  Top 0.813: U1.P$10 14.99,17.14 15.37,16.76 19.94,16.76 22.73,13.97 JP3.2
N$70  (via drill 0.4)
  Top 0.254: 24.85,7.41 L4.1
  Top 0.305: v28.96,15.75 C32.1 | v26.42,15.24 26.42,14.73 26.67,14.48 26.67,9.22 24.85,7.41
  Top 0.61: IC1.3 32.13,9.27 29.97,7.11 25.15,7.11 24.85,7.41
  Bottom 0.305: v28.96,15.75 26.92,15.75 v26.42,15.24
N$71
  Top 0.305: IC1.1 33.21,12.25 C32.2
N$72
  Top 0.305: IC1.7 39.5,10.54 39.88,10.92 39.88,13.21 39.12,13.97 34.04,13.97 32.89,15.11 32.89,17.65 32.64,17.91 31.37,17.91 R10.2
N$73
  Top 0.254: IC6.41 36.56,35.83 36.02,36.37 35.37,36.37 34.65,37.09 RN1.2
N$75
  Top 0.254: 36.83,41.91 SJ3.2 | C19.1 37.08,42.42
  Top 0.406: JP7.1 37.08,44.2 37.08,42.42 SJ3.2
N$76
  Top 0.254: IC6.42 36.06,35.56 35.81,35.81 35.05,35.81 33.85,37.01 RN1.1
N$77
  Top 0.305: R12.1 R11.2 38.1,7.37 38.1,8
  Top 0.406: 37.97,8 38.1,8 IC1.5
N$78
  Top 0.254: IC6.23 38.06,24.67 38.35,24.38 39.88,24.38 40.64,23.62 R22.2
N$79
  Top 0.254: IC6.38 38.06,37.28 RN2.1
N$80
  Top 0.254: IC6.22 37.56,24.16 37.85,23.88 38.61,23.88 39.12,23.37 C5.1
N$81
  Top 0.254: IC6.20 36.56,24.25 C3.A
N$113
  Top 0.254: R1.2 14.61,46.61 13.95,47.26 IC3.2
  Top 0.305: R1.2 17.14,46.61 X1.2 19.81,45.21 20.32,44.7 20.32,42.16 20.83,41.66 C2.2
N$114
  Top 0.203: 15.46,45.09 R1.1
  Top 0.254: R2.2 15.07,41.95
  Top 0.305: 16.26,41.95 16.98,41.95 X1.1 19.73,40.39 20.15,40.81 21.3,40.81 C8.2 | 15.46,45.09 15.75,45.09 16.26,44.58 16.26,41.95 | 15.07,41.95 16.26,41.95
N$117
  Top 0.203: 9.14,46.2 9.14,45.72 8.89,45.47 7.87,45.47 7.49,45.85 7.37,45.97 3.3,45.97 3.05,45.72 C11.1
  Top 0.254: 9.14,46.2 IC3.27
N$321
  Top 0.305: RN5.7 21.84,25.67 21.84,26.42 | 21.84,26.42 21.12,26.42 RN5.8 | C23.1 21.84,27.94 21.84,26.42
N$327
  Top 0.254: RN9.7 46.34,25.04 46.99,24.38 LED7.C
N$329  (via drill 0.4)
  Top 0.254: RN9.8 47.43,25.84 v47.5,25.91
  Bottom 0.254: U1.P$12 3.54,25.67 9.91,19.3 9.91,18.8 11.18,17.53 11.69,17.53 13.34,15.88 15.11,15.88 15.75,16.51 17.4,16.51 18.67,17.78 42.16,17.78 47.5,23.11 v47.5,25.91
RD+
  Top 0.254: IC3.29 10.16,44.96 12.19,42.93 R5.1
RD-
  Top 0.254: IC3.30 10.66,45.35 13.23,42.77 13.23,39.14 R4.1
RESET  (via drill 0.4)
  Top 0.203: ICSP.5 63.63,25.34
  Top 0.254: IC9.30 76.01,29.27 74.42,27.69 70.87,27.69 69.6,26.42 69.6,22.61 71.63,20.57 71.63,14.48 v71.88,13.97 | v69.09,9.91 69.09,19.3 68.58,19.81 63.75,19.81 | 63.75,19.81 55.12,19.81 50.29,24.64 50.29,34.54 46.74,38.1 46.74,44.45 45.97,45.21 43.43,45.21 42.67,44.45 42.67,41.15 41.91,40.39 39.62,40.39 C19.2 38.61,40.39 33.78,40.39 | 33.78,40.39 32.19,38.8 IC2.3 | R16.1 33.78,40.39 | ICSP.5 63.75,25.27 63.75,19.81
  Top 0.305: 55.63,10.92 55.63,7.11 54.36,5.84 42.16,5.84 39.37,3.05 39.37,1.65 38.86,1.14 34.42,1.14 JP6.6 | 55.63,10.92 S1.4 58.42,10.92 59.44,11.94 65.79,11.94 67.82,9.91 v69.09,9.91 | 55.63,10.92 S1.3
  Bottom 0.203: ICSP.5 63.69,25.4
  Bottom 0.254: v71.88,13.97 69.09,11.43 v69.09,9.91
RESET2  (via drill 0.4)
  Top 0.203: IC3.24 5.11,46.76 v4.95,46.86
  Top 0.305: P3.5 17.27,36.7 17.78,37.21 20.19,37.21 20.83,37.85 24.64,37.85 24.89,38.1 26.42,38.1 29.48,41.16 31.48,41.16 R17.1
  Bottom 0.254: v4.95,46.86 7.24,46.86 9.4,44.7 9.4,43.69 11.3,41.78 11.3,39.75 15.49,35.56 P3.5
RXD1  (via drill 0.4)
  Top 0.254: v84.84,35.31 84.84,33.27 83.51,31.95 IC9.45
  Bottom 0.254: v84.84,35.31 85.85,35.31 86.36,35.81 86.36,45.21 81.28,50.29 COMMUNICATION1.3
RXD2  (via drill 0.4)
  Top 0.254: v70.61,38.61 71.13,38.6 IC9.12
  Bottom 0.254: v70.61,38.61 72.9,40.89 72.9,44.96 73.66,45.72 73.66,48.26 COMMUNICATION1.5
RXD3  (via drill 0.4)
  Top 0.254: COMMUNICATION1.7 71.12,50.04 72.39,48.77 88.14,48.77 v89.15,47.75 | IC9.63 90.17,38.1 v90.68,38.61
  Bottom 0.254: v90.68,38.61 90.68,46.23 v89.15,47.75
RXIN  (via drill 0.4)
  Top 0.254: IC6.5 29.48,30.98 v28.45,32
  Top 0.305: U1.P$2 17.4,27.3 19.03,25.67 RN5.2
  Bottom 0.254: U1.P$2 13.97,28.32 15.37,29.72 17.53,29.72 18.67,28.57 25.02,28.57 v28.45,32
RXIP  (via drill 0.4)
  Top 0.254: IC6.6 28.96,30.48 v28.45,29.97
  Top 0.305: U1.P$1 17.27,28.57 19.37,26.47 RN5.1
  Bottom 0.254: U1.P$1 17.02,28.07 26.54,28.07 v28.45,29.97
RXLED
  Top 0.203: IC3.10 11.16,52.22 10.59,52.78 5.92,52.78 5.28,52.15 5.28,50.22 5.46,50.04 5.94,50.04 RN3.7
SCK2  (via drill 0.4)
  Top 0.203: v8.64,51.69 8.66,51.67
  Top 0.254: 8.66,51.67 IC3.15
  Top 0.305: v21.21,36.96 P3.3
  Bottom 0.203: 9.4,48.26 16.38,41.27 16.38,39.5 18.29,37.59 20.57,37.59 v21.21,36.96
  Bottom 0.254: v8.64,51.69 9.4,50.93 9.4,48.26
SCL  (via drill 0.4)
  Top 0.254: v83.31,33.53 82.51,32.73 IC9.43 82.51,28.23 v82.8,27.94
  Top 0.305: PWMH.10 18.8,51.82 19.05,52.07 42.98,52.07 v43.87,51.18
  Bottom 0.254: v83.31,33.53 86.87,33.53 87.38,34.04 87.38,45.72 86.36,46.74 COMMUNICATION1.1 | v82.8,27.94 82.8,24.38 86.36,20.83 JP4.2 | SJ6.1 24.38,46.48 21.84,49.02 20.57,49.02 PWMH.10
  Bottom 0.305: COMMUNICATION1.1 86.36,52.07 85.85,52.58 45.26,52.58 v43.87,51.18
SDA  (via drill 0.4)
  Top 0.254: v84.07,34.54 84.07,33.27 83.01,32.21 IC9.44 83.01,29 83.31,28.7 84.07,28.7 v85.09,27.69
  Top 0.305: v32.77,49.02 42.67,49.02 43.18,48.51 65.79,48.51 66.29,48.01 68.07,48.01 69.85,49.78 69.85,51.56 70.36,52.07 83.57,52.07 83.82,51.82 COMMUNICATION1.2
  Bottom 0.254: v84.07,34.54 86.36,34.54 86.87,35.05 86.87,45.47 83.82,48.51 COMMUNICATION1.2 | JP4.3 88.9,21.34 86.11,24.13 86.11,26.67 v85.09,27.69 | SJ5.1 26.42,45.72 PWMH.9
  Bottom 0.305: PWMH.9 21.34,51.82 21.59,52.07 32.26,52.07 32.77,51.56 v32.77,49.02
SPDLED
  Top 0.254: RN9.4 43.2,23.37 42.53,23.37 40.12,25.78 IC6.24
TXD1  (via drill 0.4)
  Top 0.254: v85.09,36.32 85.34,36.32 85.6,36.07 85.6,33.27 84.01,31.69 IC9.46
  Bottom 0.254: v85.09,36.32 85.6,36.32 85.85,36.58 85.85,44.96 81.53,49.28 79.5,49.28 78.74,50.04 COMMUNICATION1.4
TXD2  (via drill 0.4)
  Top 0.254: IC9.13 73.03,38.1 73.41,37.72 74.17,37.72 74.47,38.02 74.47,41.58 73.66,42.42 73.66,44.45 72.64,45.47 v72.64,46.48
  Bottom 0.254: v72.64,46.48 72.64,49.78 COMMUNICATION1.6
TXD3  (via drill 0.4)
  Top 0.254: COMMUNICATION1.8 68.58,52.07 69.22,52.7 87.25,52.7 v87.88,52.07 | IC9.64 89.15,38.6 89.66,39.12 v89.66,39.62
  Bottom 0.254: v89.66,39.62 89.66,45.21 87.88,46.99 v87.88,52.07
TXLED
  Top 0.203: IC3.11 10.66,51.95 10.24,52.35 6.12,52.35 5.84,52.07 5.84,51.05 5.97,50.93 5.97,50.87 RN3.8
TXON  (via drill 0.4)
  Top 0.254: v35.56,32.51 35.1,32.98 IC6.1
  Top 0.305: U1.P$6 17.4,22.23 19.25,24.07 RN5.4
  Bottom 0.254: U1.P$6 17.4,22.23 18.92,23.75 27.43,23.75 35.56,31.88 v35.56,32.51
TXOP  (via drill 0.4)
  Top 0.254: v34.04,32 33.56,32.48 IC6.2
  Top 0.305: U1.P$5 17.89,24.87 RN5.3
  Bottom 0.254: U1.P$5 17.4,24.38 26.42,24.38 v34.04,32
USB+  (via drill 0.4)
  Top 0.254: U$15.A4 7.02,39.31 U$15.B9 | U$15.A9 7.02,36.81 U$15.B4
  Top 0.406: v12.45,34.04 v12.45,34.8 11.13,34.8 F1.1
  Bottom 0.406: U$15.B4 7,36.83 8.13,36.83 10.16,34.8 v12.45,34.8 12.45,37.34 10.53,39.26 U$15.B9
USBRXD  (via drill 0.4)
  Top 0.203: RN3.5 6.69,48.46 v6.76,48.51
  Top 0.254: IC3.9 11.66,51.15 v12.06,51.56
  Bottom 0.203: 6.12,52.35 11.28,52.35
  Bottom 0.254: 11.28,52.35 v12.06,51.56 | v6.76,48.51 7.24,48.51 7.62,48.9 7.62,49.66 5.84,51.44 5.84,52.07 6.12,52.35
USBTXD  (via drill 0.4)
  Top 0.203: RN3.6 6.51,49.26 v6.76,49.51
  Top 0.305: IC3.8 12.83,50.88 12.83,52.2 12.7,52.32 v12.7,52.45
  Bottom 0.203: v12.7,52.45 12.37,52.78 5.79,52.78 5.33,52.32 5.33,50.16 5.99,49.51 v6.76,49.51
USBVCC  (via drill 0.4)
  Top 0.254: F1.2 14.35,34.46 14.35,38.48 13.72,39.12 13.72,43.05 11.16,45.61 IC3.31
  Top 0.61: F1.2 14.65,32.34 15.88,31.11 24.26,31.11 v27.43,34.29
  Bottom 0.61: JP5.1 27.18,41.91 27.94,41.15 27.94,34.8 v27.43,34.29 | v27.43,34.29 v26.67,33.53 | v27.43,34.29 27.05,33.91
VIN  (via drill 0.4)
  Top 0.254: D1.C 16,12.83
  Top 0.406: 30.99,10.54 C36.1 30.1,9.91 | 27.43,16.76 R10.1
  Top 0.61: 30.99,10.54 IC1.2
  Top 0.813: v27.43,9.91 30.1,9.91 | JP3.4 26.67,19.05 27.43,18.29 27.43,16.76 v27.43,9.91 | v27.43,9.14 v27.43,9.91 | v19.3,13.46 16.72,13.46 D1.C
  Bottom 0.813: 23.37,8.64 19.81,8.64 18.54,9.91 v18.54,13.46 | v27.43,10.67 v27.43,9.14 26.92,8.64 23.37,8.64 | v18.54,13.46 v19.3,13.46 | v17.78,13.46 v18.54,13.46 | JP6.1 45.72,1.52 45.09,0.89 24.26,0.89 23.37,1.78 23.37,8.64
WIZRST  (via drill 0.4)
  Top 0.254: RN2.2 38.72,36.68 38.56,36.53 IC6.37 38.56,33.48 v37.85,32.77 | v31.75,35.31 32.19,35.75 IC2.2
  Bottom 0.254: v37.85,32.77 35.31,35.31 v31.75,35.31
XTAL1
  Top 0.254: IC9.34 78.01,27.72 76.96,26.67 X3.1 76.96,24.38 77.34,24 C21.2 R7.1
XTAL2
  Top 0.254: X3.2 74.8,25.53 77.51,27.98 IC9.33 | C20.2 74.17,22.1 74.42,21.84 74.42,20.83 74.68,20.57 R7.2
  Top 0.305: X3.2 72.14,24.89 73.49,23.46 C20.2
XTLN
  Top 0.254: 44.32,33.53 44.32,36.07 43.81,36.58 43.81,42.29 X2.1 | 44.32,33.53 C15.1 | 44.32,33.53 44.32,32.13 R3.1 43.43,32 41.91,30.48 IC6.31
  Top 0.305: C15.1 43.31,33.4
XTLP
  Top 0.254: X2.2 44.96,38.61 44.96,33.78 45.34,33.4 45.97,33.4 | C16.1 45.97,33.4 | IC6.30 42.42,29.98 43.43,30.99 44.7,30.99 R3.2 45.97,32.26 45.97,33.4